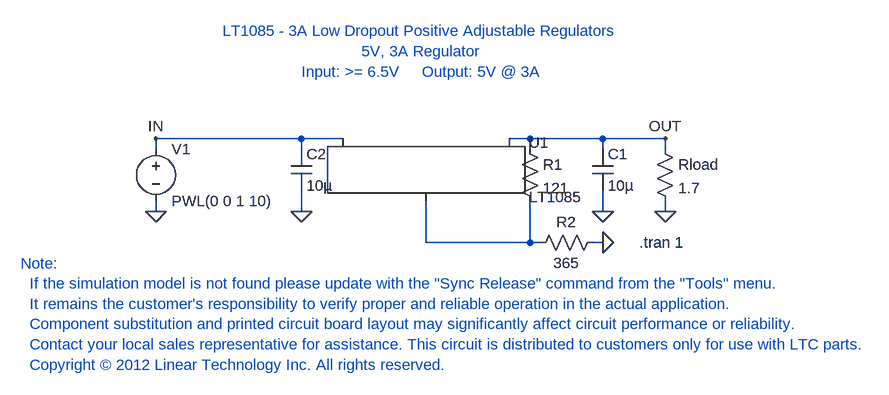
[diagram p0: schematic LT1085_TA01.asc]
LT1085_TA01.asc, the LTspice schematic file:
Version 4
SHEET 1 2816 1520
WIRE 1488 896 1264 896
WIRE 1552 896 1488 896
WIRE 1840 896 1808 896
WIRE 1952 896 1840 896
WIRE 2048 896 1952 896
WIRE 1264 912 1264 896
WIRE 1488 912 1488 896
WIRE 1840 912 1840 896
WIRE 1952 912 1952 896
WIRE 2048 912 2048 896
WIRE 1264 1008 1264 992
WIRE 1488 1008 1488 976
WIRE 1952 1008 1952 976
WIRE 2048 1008 2048 992
WIRE 1680 1056 1680 992
WIRE 1840 1056 1840 992
WIRE 1840 1056 1680 1056
WIRE 1856 1056 1840 1056
WIRE 1952 1056 1936 1056
FLAG 2048 896 OUT
FLAG 1952 1056 0
FLAG 2048 1008 0
FLAG 1264 1008 0
FLAG 1952 1008 0
FLAG 1264 896 IN
FLAG 1488 1008 0
SYMBOL RES 1824 896 R0
SYMATTR InstName R1
SYMATTR Value 121
SYMBOL RES 1840 1072 R270
WINDOW 0 32 56 VTop 2
WINDOW 3 0 56 VBottom 2
SYMATTR InstName R2
SYMATTR Value 365
SYMBOL VOLTAGE 1264 896 R0
WINDOW 123 0 0 Left 2
SYMATTR InstName V1
SYMATTR Value PWL(0 0 1 10)
SYMATTR SpiceLine Rser=0.1
SYMBOL RES 2032 896 R0
SYMATTR InstName Rload
SYMATTR Value 1.7
SYMBOL cap 1936 912 R0
SYMATTR InstName C1
SYMATTR Value 10µ
SYMBOL cap 1472 912 R0
SYMATTR InstName C2
SYMATTR Value 10µ
SYMBOL PowerProducts\\LT1085 1680 896 R0
SYMATTR InstName U1
TEXT 2008 1056 Left 2 !.tran 1
TEXT 1672 808 Bottom 2 ;LT1085 - 3A Low Dropout Positive Adjustable Regulators\n5V, 3A Regulator\nInput: >= 6.5V     Output: 5V @ 3A
TEXT 1056 1088 Left 2 ;Note:\n  If the simulation model is not found please update with the "Sync Release" command from the "Tools" menu.\n  It remains the customer's responsibility to verify proper and reliable operation in the actual application.\n  Component substitution and printed circuit board layout may significantly affect circuit performance or reliability.\n  Contact your local sales representative for assistance. This circuit is distributed to customers only for use with LTC parts.\n  Copyright © 2012 Linear Technology Inc. All rights reserved.

The netlist it stands for:
* LT1085_TA01.asc
R1 OUT N001 121
R2 N001 0 365
V1 IN 0 PWL(0 0 1 10) Rser=0.1
Rload OUT 0 1.7
C1 OUT 0 10µ
C2 IN 0 10µ
XU1 N001 OUT IN LT1085
.tran 1
* LT1085 - 3A Low Dropout Positive Adjustable Regulators
* 5V, 3A Regulator
* Input: >= 6.5V     Output: 5V @ 3A
* Note:
*   If the simulation model is not found please update with the "Sync Release" command from the "Tools" menu.
*   It remains the customer's responsibility to verify proper and reliable operation in the actual application.
*   Component substitution and printed circuit board layout may significantly affect circuit performance or reliability.
*   Contact your local sales representative for assistance. This circuit is distributed to customers only for use with LTC parts.
*   Copyright © 2012 Linear Technology Inc. All rights reserved.
.backanno
.end